# EasyEDA schematic MCBAC_CIRCUIT_V1.1.json
TITLE: MCBAC SCHEMATIC; REV: 1.1; Date: 2020-03-10; Sheet: 1/1; Drawn By: WestleyR; Company: Hobbyist
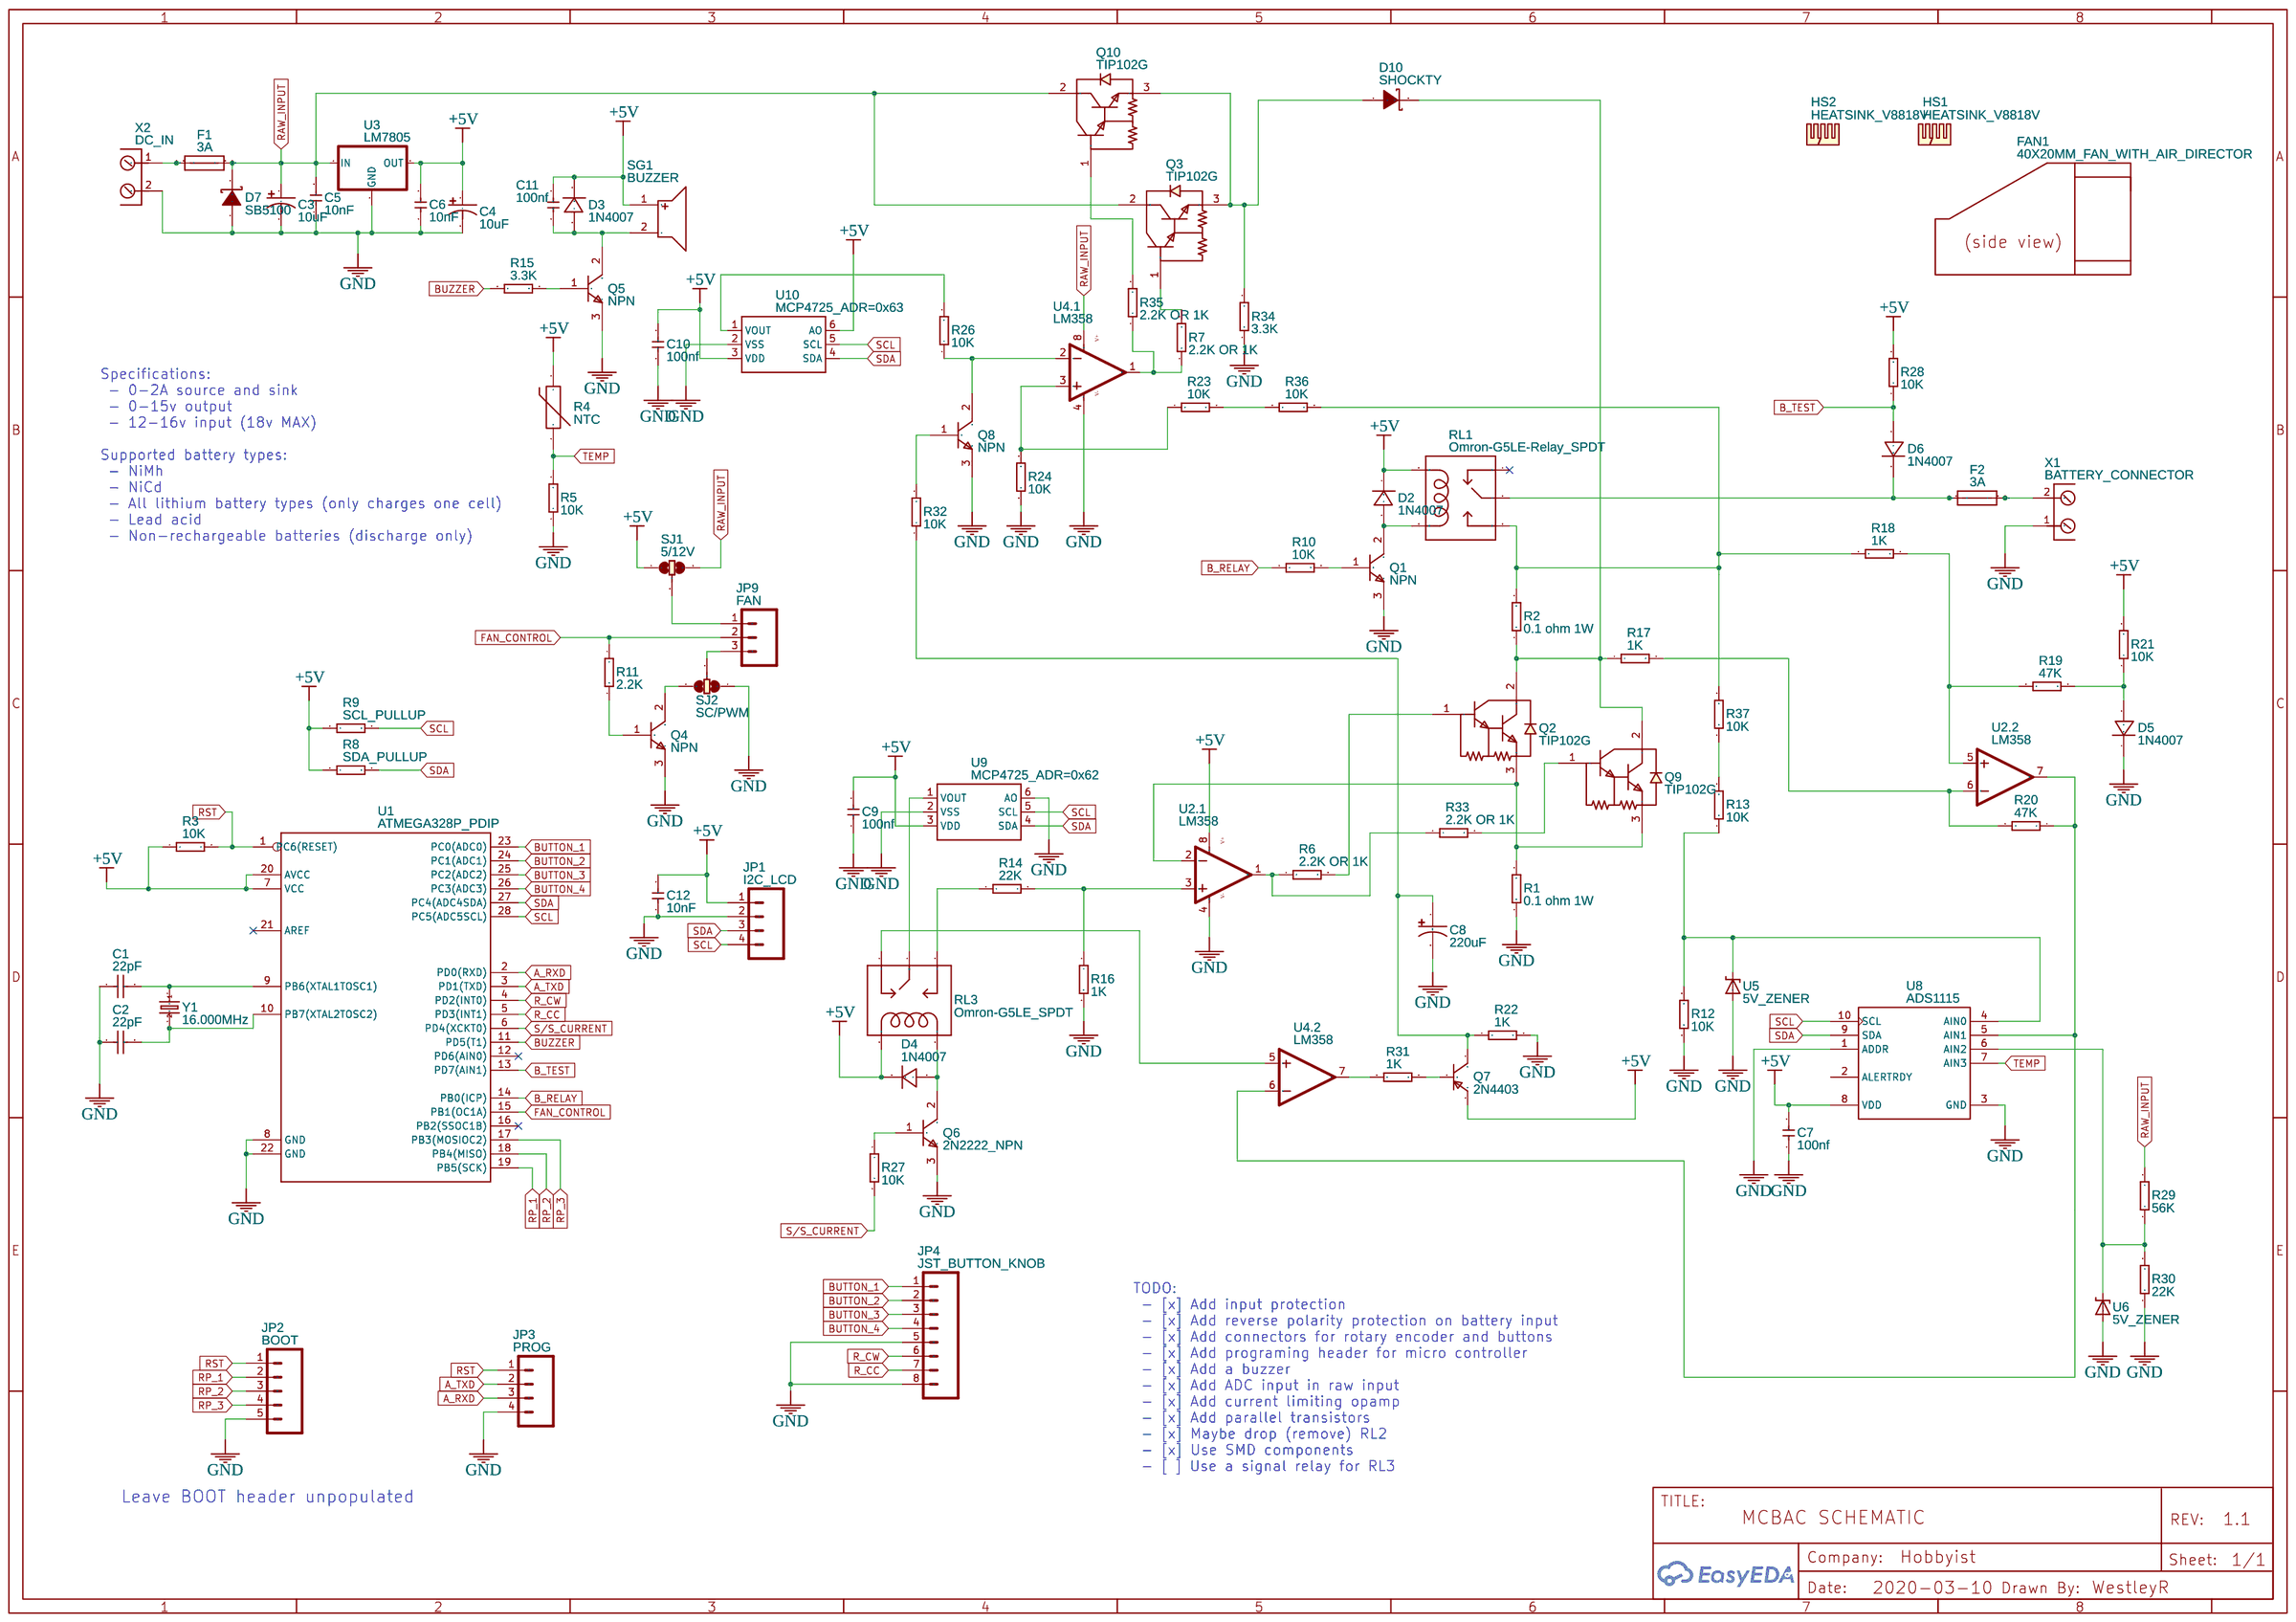
[diagram p0: schematic sheet]

## Parts
C1  22pF  [C0201]
C2  22pF  [C0201]
C3  10uF  [CPOL-RADIAL-100UF-25V]
C4  10uF  [CPOL-RADIAL-100UF-25V]
C5  10nF  [C0201]
C6  10nF  [C0201]
C7  100nf  [C0201]
C8  220uF  [CAP-D12.5XF5.0]
C9  100nf  [CERAMIC-2.54]
C10  100nf  [C0201]
C11  100nf  [C0201]
C12  10nF  [C0201]
D2  1N4007  [SMA_L4.4-W2.6-LS5.0-BI]
D3  1N4007  [SMA_L4.4-W2.6-LS5.0-BI]
D4  1N4007  [SMA_L4.4-W2.6-LS5.0-BI]
D5  1N4007  [SMA_L4.4-W2.6-LS5.0-BI]
D6  1N4007  [DO-41_BD2.4-L4.7-P8.70-D0.9-RD]
D7  SB5100  [DO-201AD_BD5.3-L8.4-P12.50-D1.4-RD]
D10  SHOCKTY  [DO-201AD_BD5.3-L8.4-P12.50-D1.4-RD]
F1  3A  [FH_5X20]
F2  3A  [FH_5X20]
FAN1  40X20MM_FAN_WITH_AIR_DIRECTOR  [40X20MM_PCB_FAN_2X_BRACKET_WITH_AIR_DIRECTOR]
HS1  HEATSINK_V8818V  [HEATSINK_V8818V]
HS2  HEATSINK_V8818V  [HEATSINK_V8818V]
JP1  I2C_LCD  [PKG-B4B-XH-A(LF)(SN)]
JP2  BOOT  [1X05_LONGPADS]
JP3  PROG  [1X04_LONGPADS]
JP4  JST_BUTTON_KNOB  [PEMC1-8]
JP9  FAN  [1X03_LONGPADS]
Q1  NPN  [SOT-23-3_L2.9-W1.6-P1.90-LS2.8-BR-CW]
Q2  TIP102G  [TO-220]
Q3  TIP102G  [TO-220]
Q4  NPN  [SOT-23-3_L2.9-W1.6-P1.90-LS2.8-BR-CW]
Q5  NPN  [SOT-23-3_L2.9-W1.6-P1.90-LS2.8-BR-CW]
Q6  2N2222_NPN  [SOT-23-3_L2.9-W1.6-P1.90-LS2.8-BR-CW]
Q7  2N4403  [SOT-23-3_L2.9-W1.6-P1.90-LS2.8-BR-CW]
Q8  NPN  [SOT-23-3_L2.9-W1.6-P1.90-LS2.8-BR-CW]
Q9  TIP102G  [TO-220]
Q10  TIP102G  [TO-220]
R1  0.1 ohm 1W  [1W RESISTOR]
R2  0.1 ohm 1W  [1W RESISTOR]
R3  10K  [R0603]
R4  NTC  [LED_STANDOFF]
R5  10K  [R0603]
R6  2.2K OR 1K  [R0603]
R7  2.2K OR 1K  [R0603]
R8  SDA_PULLUP  [R0603]
R9  SCL_PULLUP  [R0603]
R10  10K  [R0603]
R11  2.2K  [R0603]
R12  10K  [R0603]
R13  10K  [R0603]
R14  22K  [R0603]
R15  3.3K  [R0603]
R16  1K  [R0603]
R17  1K  [R0603]
R18  1K  [R0603]
R19  47K  [R0603]
R20  47K  [RTH025W]
R21  10K  [R0603]
R22  1K  [R0603]
R23  10K  [R0603]
R24  10K  [R0603]
R26  10K  [R0603]
R27  10K  [R0603]
R28  10K  [R0603]
R29  56K  [R0603]
R30  22K  [R0603]
R31  1K  [R0603]
R32  10K  [R0603]
R33  2.2K OR 1K  [R0603]
R34  3.3K  [R0603]
R35  2.2K OR 1K  [R0603]
R36  10K  [R0603]
R37  10K  [R0603]
RL1  Omron-G5LE-Relay_SPDT  [OMRON_G5LE_SPDT_RELAY]
RL3  Omron-G5LE_SPDT  [OMRON_G5LE_SPDT_RELAY]
SG1  BUZZER  [DIP-BUZZER-12X7.5]
SJ1  5/12V  [SJ_3]
SJ2  SC/PWM  [SJ_3]
U1  ATMEGA328P_PDIP  [DIL28-3]
U2  LM358  [DIP08]  (sections 1,2)
U3  LM7805  [TO-252-3_L6.5-W5.8-P4.58-BR]
U4  LM358  [DIP08]  (sections 1,2)
U5  5V_ZENER  [SOD-123FL_L2.7-W1.8-LS3.8-RD]
U6  5V_ZENER  [SOD-123FL_L2.7-W1.8-LS3.8-RD]
U8  ADS1115  [MSOP10]
U9  MCP4725_ADR=0x62  [SOT23-6]
U10  MCP4725_ADR=0x63  [SOT23-6]
X1  BATTERY_CONNECTOR  [2 PIN 5 MM CONNECTOR]
X2  DC_IN  [2 PIN 5 MM CONNECTOR]
Y1  16.000MHz  [HC-49US_L11.5-W4.5-P4.88]

## Library data of the parts
C1 C2 = 22pF: Supplier Part: undefined; Supplier: LCSC; Manufacturer: LCSC; Manufacturer Part: 22K-50V
C3 C4 = 100UF-25V-20%(PTH): CAP-08439; Contributor: SparkFun
C5-C7 C9-C12 = DIP-CERAMIC-22PF-100V-5%-NPO(D5.0MM): Manufacturer Part: ?
C8 = Cap_Electrolytic(TH)_D12.5XF5.0_US
D2-D6 = 1N4007: Contributor: andyfierman; sourceId: i60Uc6M3X; link: http://www.onsemi.com/PowerSolutions/product.do?id=1N4007; sim: true
D7 D10 = SB5100: Supplier: LCSC; Manufacturer: SMC; Contributor: LCSC; Supplier Part: C139685
F1 F2 = FH_5X20
FAN1 = 40X20MM_FAN_WITH_AIR_DIRECTOR: Contributor: WestleyR
HS1 HS2 = HEATSINK_V8818V: Contributor: WestleyR; license: https://www.gnu.org/licenses/lgpl-2.1.html; link: http://www.assmann-wsw.com/fileadmin/datasheets/ASS_0873_HS.pdf
JP1 JP3 = M04LONGPADS: Header 4; Contributor: SparkFun
JP2 = M05: Contributor: SparkFun
JP4 = M08LONGPADS: Header 8; Contributor: SparkFun
JP9 = M03LONGPADS: Header 3; Contributor: SparkFun
Q1 Q4-Q6 Q8 = P2N2222ARL1G: Amplifier Transistor, NPN Silicon, 3-Pin TO-92, Pb-Free, Tape and Reel
Q2 Q3 Q9 Q10 = TIP102G: Plastic Medium-Power, Complementary Silicon Transistor, 3-Pin TO-220, Pb-Free, Tube
Q7 = 2N4403: Supplier: LCSC; Supplier Part: C113374; Manufacturer: ON Semicon; Contributor: Brevor
R1 R2 = 1W RESISTOR: Contributor: DangerousPrototype
R3 R5-R24 R26-R37 = RESISTOR: Contributor: DangerousPrototype
R4 = FM72-5D11: Supplier Part: undefined; Supplier: LCSC; Manufacturer: RUILON
RL1 RL3 = Omron-G5LE-Relay_SPDT: sourceId: Wgs2ZXjTR
SG1 = BUZZER-7.5mm: Supplier Part: C96094; Supplier: LCSC; Manufacturer: HNDZ; Manufacturer Part: buzzerHMB1275-12B; Contributor: felixzhdanov
SJ1 SJ2 = SOLDERJUMPER_2WAY-OLDS: Solder Jumper; Contributor: SparkFun
U1 = ATMEGA328P_PDIP: Contributor: SparkFun
U2 U4 = LM358: Contributor: SparkFun; subpart_no: 1
U3 = 7805
U5 U6 = DIODE-ZENER: Contributor: SparkFun
U8 = ADS1115QDGSRQ1: Automotive Catalog 16-Bit ADC with Integrated Multiplexer, PGA, Comparator, Oscillator, and Reference, -40 to 125 degC, 10-pin SOP (DGS10), Green (RoHS  no SbBr)
U9 U10 = MCP4725SOT-23: Microchip 12-bit I2C DAC, SOT23-6; Contributor: SparkFun
X1 X2 = 2 Pin Connector 5mm
Y1 = HC-49US    16.000MHz: DIP Crystal 16MHz-18pF-30ppm-40R;

## Nets
+5V: C4.1(+) C6.2 C7.2 C9.2 C10.2 C11.1 C12.2 D2.1(C) D3.1(C) D4.1(C) JP1.1 Q7.3(E) R3.1 R4.1 R8.1 R9.1 R21.2 R28.2 RL1.2(COIL2) RL3.2(COIL2) SG1.1 SJ1.1 U1.7(VCC) U1.20(AVCC) U2.8(V+) U3.2(OUT) U8.8(VDD) U9.3(VDD) U10.3(VDD) U10.6(AO)
GND: C1.1 C2.1 C3.2(-) C4.2(-) C5.1 C6.1 C7.1 C8.2 C9.1 C10.1 C12.1 D5.1(C) D7.2(A) JP1.2 JP2.5 JP3.4 JP4.5 JP4.8 Q1.3(E) Q4.3(E) Q5.3(E) Q6.3(E) Q8.3(E) R1.1 R5.1 R12.1 R16.2 R22.2 R24.1 R30.1 R34.1 SJ2.1 U1.8(GND) U1.22(GND) U2.4(V-) U3.1(GND) U4.4(V-) U5.P$2(A) U6.P$2(A) U8.1(ADDR) U8.3(GND) U9.2(VSS) U9.6(AO) U10.2(VSS) X1.1 X2.2
A_RXD: JP3.3 U1.2(PD0(RXD))
A_TXD: JP3.2 U1.3(PD1(TXD))
B_RELAY: R10.1 U1.14(PB0(ICP))
B_TEST: D6.2(A) R28.1 U1.13(PD7(AIN1))
BUTTON_1: JP4.1 U1.23(PC0(ADC0))
BUTTON_2: JP4.2 U1.24(PC1(ADC1))
BUTTON_3: JP4.3 U1.25(PC2(ADC2))
BUTTON_4: JP4.4 U1.26(PC3(ADC3))
BUZZER: R15.1 U1.11(PD5(T1))
FAN_CONTROL: JP9.2 R11.1 U1.15(PB1(OC1A))
R_CC: JP4.7 U1.5(PD3(INT1))
R_CW: JP4.6 U1.4(PD2(INT0))
RAW_INPUT: C3.1(+) C5.2 D7.1(K) F1.2A F1.2B Q3.2(C) Q10.2(C) R29.2 SJ1.3 U3.3(IN) U4.8(V+)
RP_1: JP2.2 U1.19(PB5(SCK))
RP_2: JP2.3 U1.18(PB4(MISO))
RP_3: JP2.4 U1.17(PB3(MOSIOC2))
RST: JP2.1 JP3.1 R3.2 U1.1(PC6(RESET))
S/S_CURRENT: R27.2 U1.6(PD4(XCKT0))
SCL: JP1.4 R9.2 U1.28(PC5(ADC5SCL)) U8.10(SCL) U9.5(SCL) U10.5(SCL)
SDA: JP1.3 R8.2 U1.27(PC4(ADC4SDA)) U8.9(SDA) U9.4(SDA) U10.4(SDA)
TEMP: R4.2 R5.2 U8.7(AIN3)
Net-(C1-2): C1.2 U1.9(PB6(XTAL1TOSC1)) Y1.1
Net-(C2-2): C2.2 U1.10(PB7(XTAL2TOSC2)) Y1.2
Net-(C8-1): C8.1 Q7.2(C) R22.1 R32.1
Net-(C11-2): C11.2 D3.2(A) Q5.2(C) SG1.2
Net-(D2-2): D2.2(A) Q1.2(C) RL1.5(COIL1)
Net-(D4-2): D4.2(A) Q6.2(C) RL3.5(COIL1)
Net-(D5-2): D5.2(A) R19.2 R21.1
Net-(D6-1): D6.1(C) F2.1A F2.1B RL1.1(MAIN)
Net-(D10-1): D10.1(K) Q2.2(C) Q9.2(C) R2.1 R17.1
Net-(D10-2): D10.2(A) Q3.3(E) Q10.3(E) R34.2
Net-(F1-1A): F1.1A F1.1B X2.1
Net-(F2-2A): F2.2A F2.2B X1.2
Net-(JP9-1): JP9.1 SJ1.2
Net-(JP9-3): JP9.3 SJ2.2
Net-(Q1-1): Q1.1(B) R10.2
Net-(Q2-1): Q2.1(B) R6.2
Net-(Q2-3): Q2.3(E) Q9.3(E) R1.2 U2.2(-IN)
Net-(Q3-1): Q3.1(B) R7.2
Net-(Q4-1): Q4.1(B) R11.2
Net-(Q4-2): Q4.2(C) SJ2.3
Net-(Q5-1): Q5.1(B) R15.2
Net-(Q6-1): Q6.1(B) R27.1
Net-(Q7-1): Q7.1(B) R31.1
Net-(Q8-1): Q8.1(B) R32.2
Net-(Q8-2): Q8.2(C) R26.1 U4.2(-IN)
Net-(Q9-1): Q9.1(B) R33.2
Net-(Q10-1): Q10.1(B) R35.2
Net-(R2-2): R2.2 R18.1 R36.2 R37.2 RL1.3(NO)
Net-(R6-1): R6.1 R33.1 U2.1(OUT)
Net-(R7-1): R7.1 R35.1 U4.1(OUT)
Net-(R12-2): R12.2 R13.1 U5.P$1(C) U8.4(AIN0)
Net-(R13-2): R13.2 R37.1
Net-(R14-1): R14.1 RL3.3(NO)
Net-(R14-2): R14.2 R16.1 U2.3(+IN)
Net-(R17-2): R17.2 R20.2 U2.6(-IN)
Net-(R18-2): R18.2 R19.1 U2.5(+IN)
Net-(R20-1): R20.1 U2.7(OUT) U4.6(-IN) U8.5(AIN1)
Net-(R23-1): R23.1 R24.2 U4.3(+IN)
Net-(R23-2): R23.2 R36.1
Net-(R26-2): R26.2 U10.1(VOUT)
Net-(R29-1): R29.1 R30.2 U6.P$1(C) U8.6(AIN2)
Net-(R31-2): R31.2 U4.7(OUT)
Net-(RL3-1): RL3.1(MAIN) U9.1(VOUT)
Net-(RL3-4): RL3.4(NC) U4.5(+IN)

Not connected (* = marked no-connect by the designer): RL1 4(NC)*; U1 12(PD6(AIN0))* 16(PB2(SSOC1B))* 21(AREF)*; U8 2(ALERTRDY)

## Notes on the sheet
- Specifications:
   - 0-2A source and sink
   - 0-15v output
   - 12-16v input (18v MAX)
  Supported battery types:
   - NiMh
   - NiCd
   - All lithium battery types (only charges one cell)
   - Lead acid
   - Non-rechargeable batteries (discharge only)
- TODO:
   - [x] Add input protection
   - [x] Add reverse polarity protection on battery input
   - [x] Add connectors for rotary encoder and buttons
   - [x] Add programing header for micro controller
   - [x] Add a buzzer
   - [x] Add ADC input in raw input
   - [x] Add current limiting opamp
   - [x] Add parallel transistors
   - [x] Maybe drop (remove) RL2
   - [x] Use SMD components
   - [ ] Use a signal relay for RL3
- Leave BOOT header unpopulated
